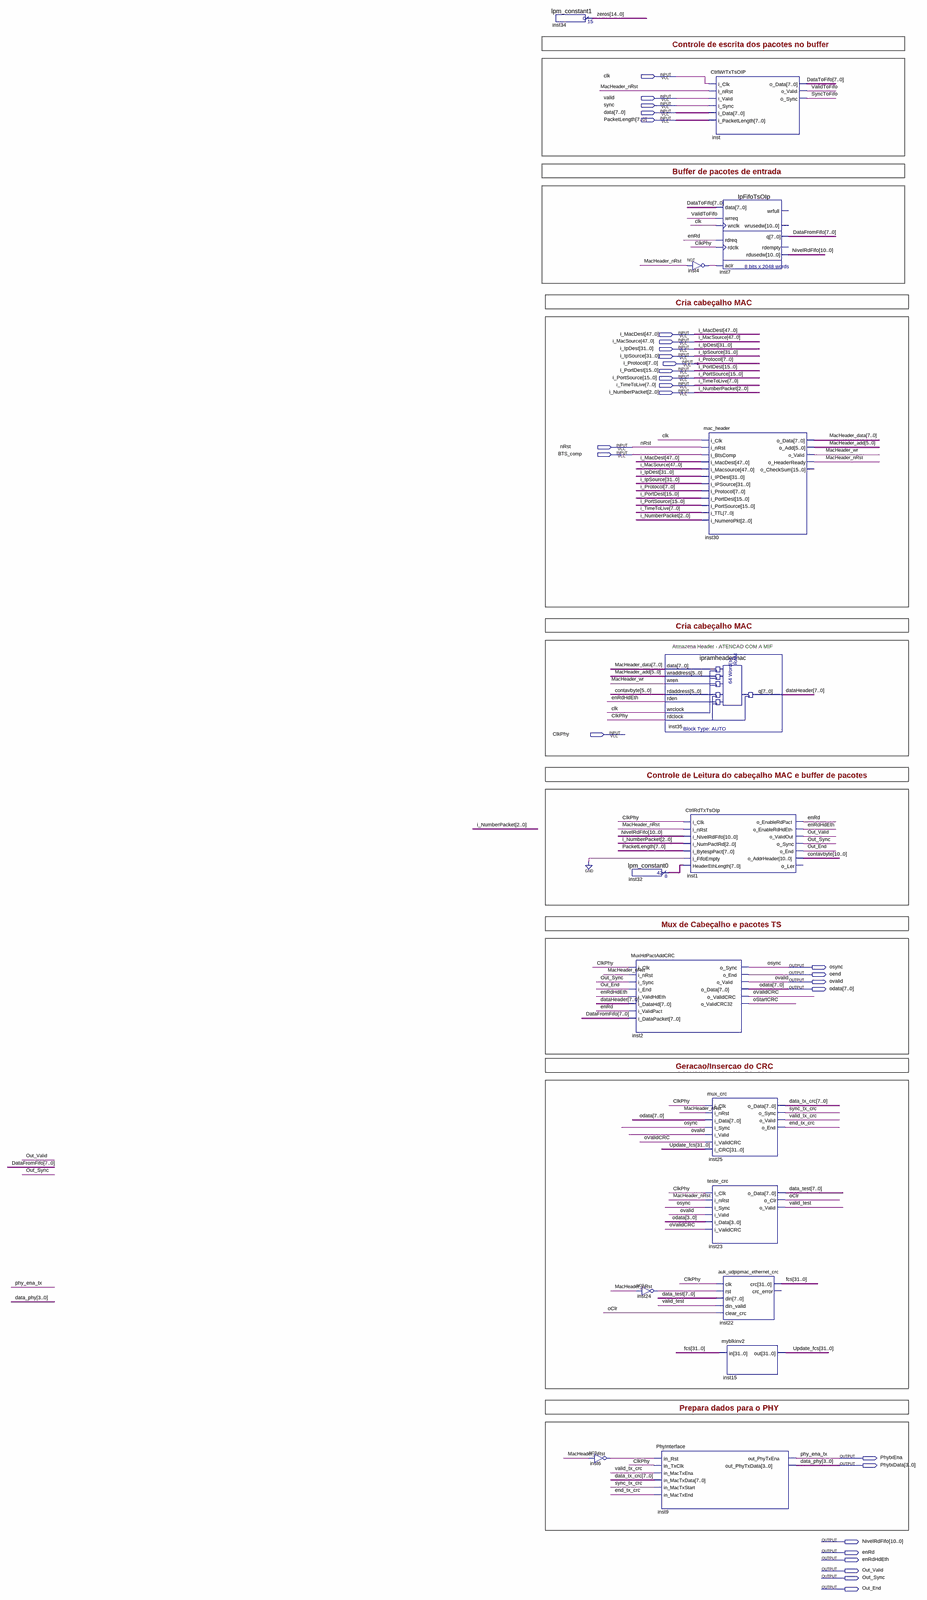
[diagram p0: schematic sheet, whole]
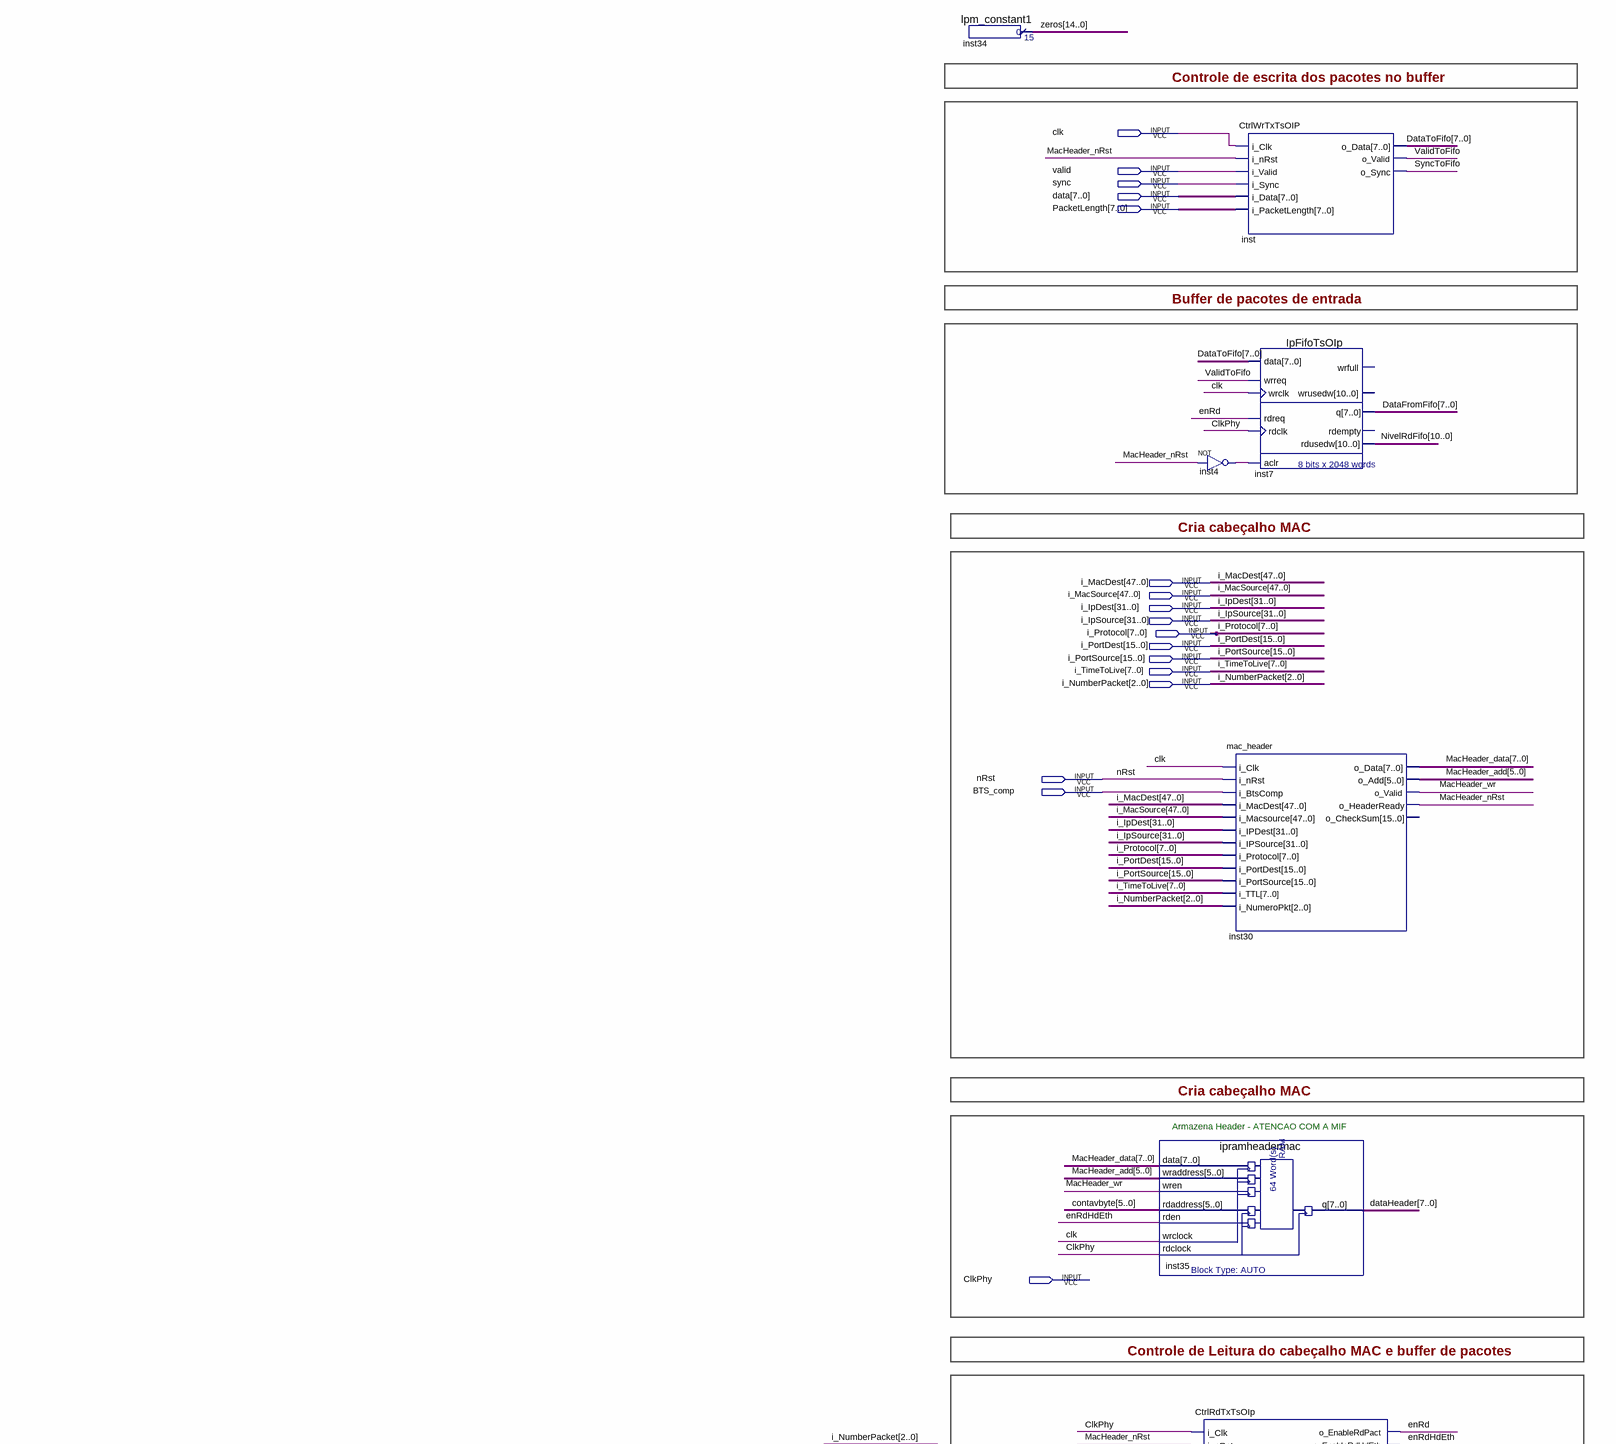
[diagram p1: schematic sheet, upper part]
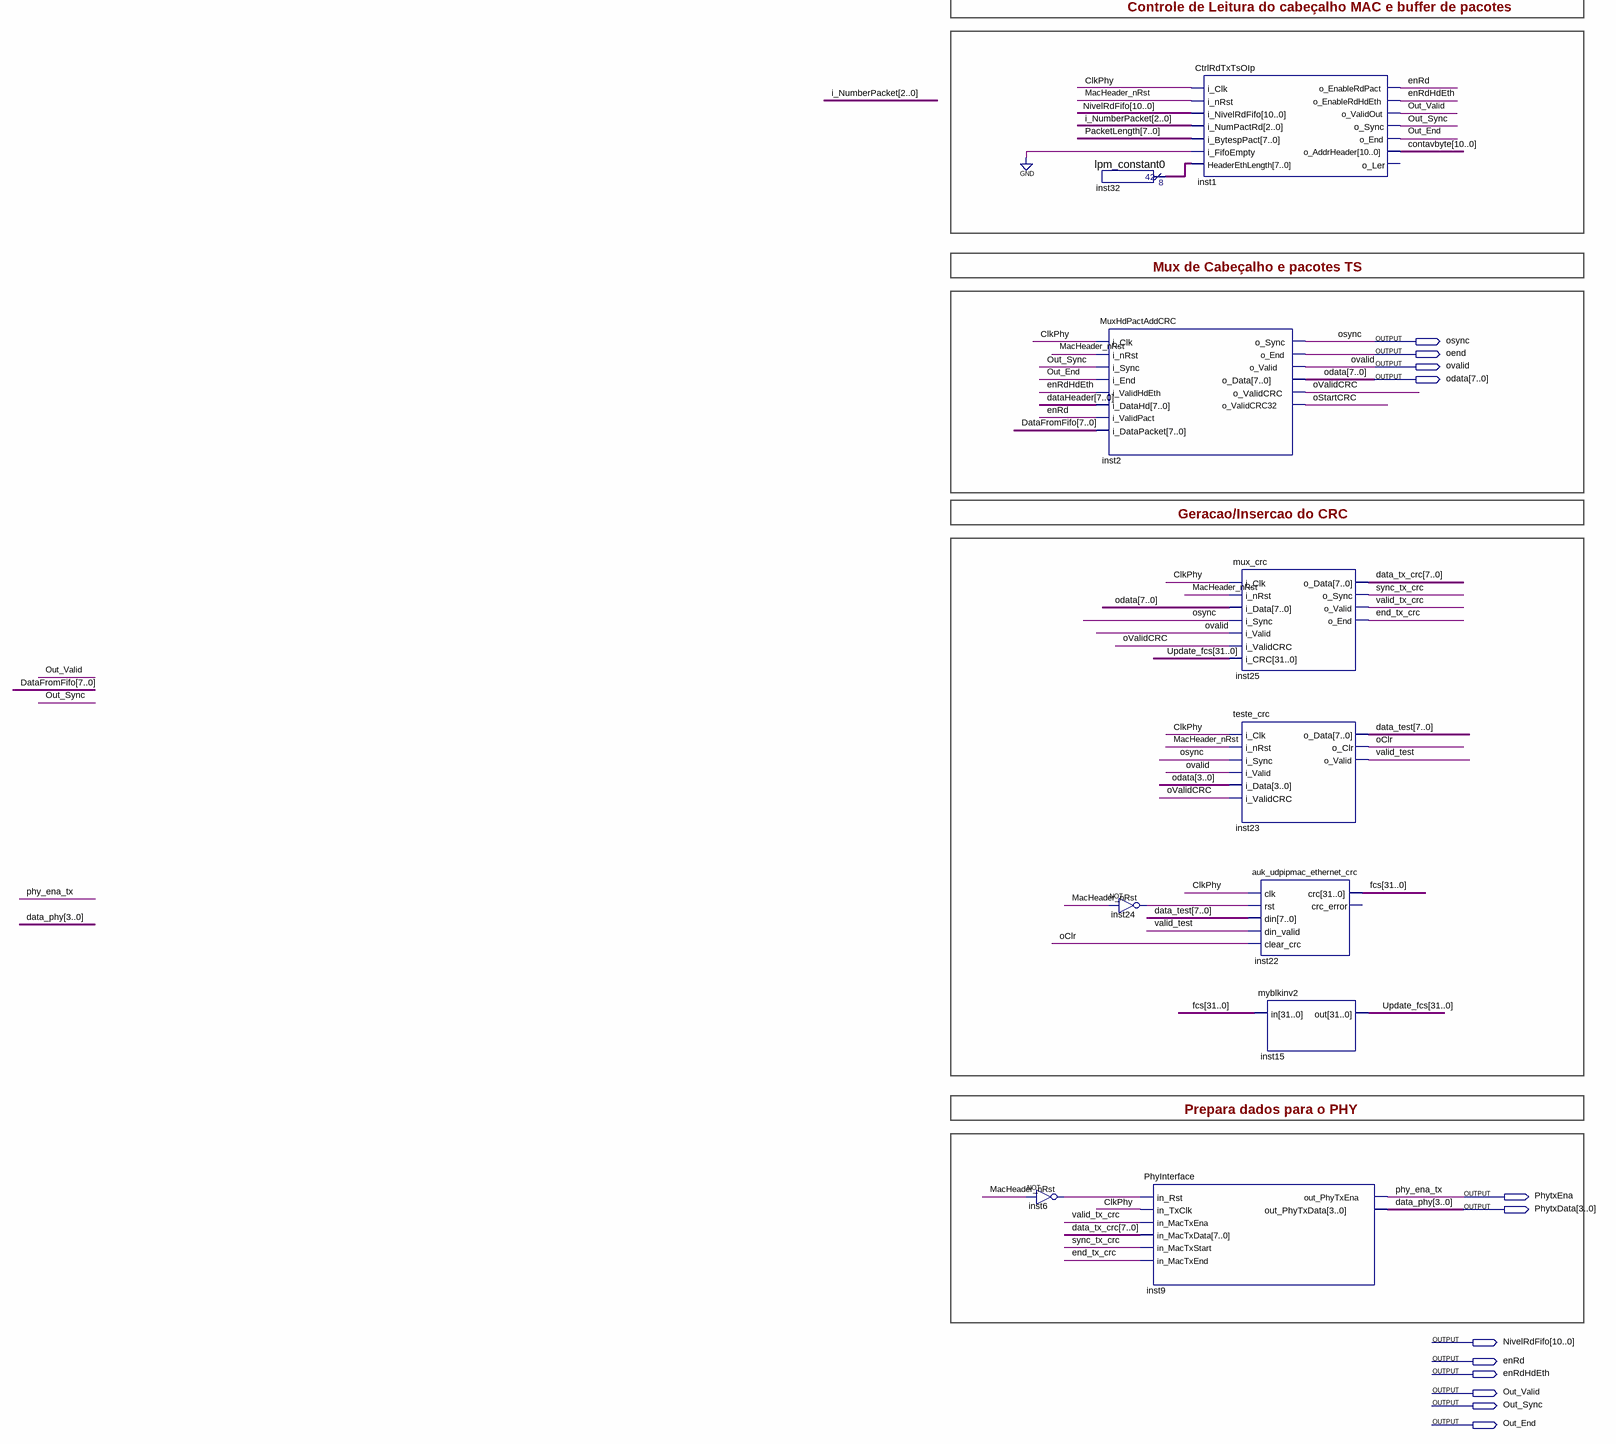
[diagram p2: schematic sheet, lower part]
// Quartus schematic TOP_TsOIp.bdf as structural Verilog: 16 symbols, 29 pins
module TOP_TsOIp (
  input  clk,
  input  valid,
  input  sync,
  input  [7:0] data,
  input  [7:0] PacketLength,
  input  [47:0] i_MacDest,
  input  [47:0] i_MacSource,
  input  [31:0] i_IpDest,
  input  [31:0] i_IpSource,
  input  [7:0] i_Protocol,
  input  [15:0] i_PortDest,
  input  [15:0] i_PortSource,
  input  [7:0] i_TimeToLive,
  input  [2:0] i_NumberPacket,
  input  nRst,
  input  BTS_comp,
  input  ClkPhy,
  output osync,
  output oend,
  output ovalid,
  output [7:0] odata,
  output PhytxEna,
  output [3:0] PhytxData,
  output [10:0] NivelRdFifo,
  output enRd,
  output enRdHdEth,
  output Out_Valid,
  output Out_Sync,
  output Out_End
);

  wire end_tx_crc, inst4_out, inst6_out, inst24_out, MacHeader_nRst, MacHeader_wr, oClr, oStartCRC,
       oValidCRC, sync_tx_crc, SyncToFifo, valid_test, valid_tx_crc, ValidToFifo;
  wire [5:0] MacHeader_add;
  wire [7:0] data_test, data_tx_crc, DataFromFifo, dataHeader, DataToFifo, inst32_result, MacHeader_data;
  wire [10:0] contavbyte;
  wire [14:0] zeros;
  wire [31:0] fcs, Update_fcs;

  lpm_constant1 inst34 (.result(zeros));
  not inst6 (inst6_out, MacHeader_nRst);
  lpm_constant0 inst32 (.result(inst32_result));
  MuxHdPactAddCRC inst2 (
    .i_Clk(ClkPhy), .i_nRst(MacHeader_nRst), .i_Sync(Out_Sync), .i_End(Out_End), .i_ValidHdEth(enRdHdEth),
    .i_DataHd(dataHeader), .i_ValidPact(enRd), .i_DataPacket(DataFromFifo), .o_Sync(osync), .o_End(oend),
    .o_Valid(ovalid), .o_Data(odata), .o_ValidCRC(oValidCRC), .o_ValidCRC32(oStartCRC));
  not inst24 (inst24_out, MacHeader_nRst);
  PhyInterface inst9 (
    .in_Rst(inst6_out), .in_TxClk(ClkPhy), .in_MacTxEna(valid_tx_crc), .in_MacTxData(data_tx_crc),
    .in_MacTxStart(sync_tx_crc), .in_MacTxEnd(end_tx_crc), .out_PhyTxEna(PhytxEna), .out_PhyTxData(PhytxData));
  ipramheadermac inst35 (
    .data(MacHeader_data), .wraddress(MacHeader_add), .wren(MacHeader_wr), .rdaddress(contavbyte[5:0]),
    .rden(enRdHdEth), .wrclock(clk), .rdclock(ClkPhy), .q(dataHeader));
  CtrlRdTxTsOIp inst1 (
    .i_Clk(ClkPhy), .i_nRst(MacHeader_nRst), .i_NivelRdFifo(NivelRdFifo), .i_NumPactRd(i_NumberPacket),
    .i_BytespPact(PacketLength), .i_FifoEmpty(1'b0), .HeaderEthLength(inst32_result), .o_EnableRdPact(enRd),
    .o_EnableRdHdEth(enRdHdEth), .o_ValidOut(Out_Valid), .o_Sync(Out_Sync), .o_End(Out_End),
    .o_AddrHeader(contavbyte));  // open: o_Ler
  CtrlWrTxTsOIP inst (
    .i_Clk(clk), .i_nRst(MacHeader_nRst), .i_Valid(valid), .i_Sync(sync), .i_Data(data),
    .i_PacketLength(PacketLength), .o_Data(DataToFifo), .o_Valid(ValidToFifo), .o_Sync(SyncToFifo));
  not inst4 (inst4_out, MacHeader_nRst);
  mac_header inst30 (
    .i_Clk(clk), .i_nRst(nRst), .i_BtsComp(BTS_comp), .i_MacDest(i_MacDest), .i_Macsource(i_MacSource),
    .i_IPDest(i_IpDest), .i_IPSource(i_IpSource), .i_Protocol(i_Protocol), .i_PortDest(i_PortDest),
    .i_PortSource(i_PortSource), .i_TTL(i_TimeToLive), .i_NumeroPkt(i_NumberPacket), .o_Data(MacHeader_data),
    .o_Add(MacHeader_add), .o_Valid(MacHeader_wr), .o_HeaderReady(MacHeader_nRst));  // open: o_CheckSum
  mux_crc inst25 (
    .i_Clk(ClkPhy), .i_nRst(MacHeader_nRst), .i_Data(odata), .i_Sync(osync), .i_Valid(ovalid),
    .i_ValidCRC(oValidCRC), .i_CRC(Update_fcs), .o_Data(data_tx_crc), .o_Sync(sync_tx_crc),
    .o_Valid(valid_tx_crc), .o_End(end_tx_crc));
  teste_crc inst23 (
    .i_Clk(ClkPhy), .i_nRst(MacHeader_nRst), .i_Sync(osync), .i_Valid(ovalid), .i_Data(odata[3:0]),
    .i_ValidCRC(oValidCRC), .o_Data(data_test), .o_Clr(oClr), .o_Valid(valid_test));
  IpFifoTsOIp inst7 (
    .data(DataToFifo), .wrreq(ValidToFifo), .wrclk(clk), .rdreq(enRd), .rdclk(ClkPhy), .aclr(inst4_out),
    .q(DataFromFifo), .rdusedw(NivelRdFifo));  // open: wrfull, wrusedw, rdempty
  auk_udpipmac_ethernet_crc inst22 (
    .clk(ClkPhy), .rst(inst24_out), .din(data_test), .din_valid(valid_test), .clear_crc(oClr), .crc(fcs));  // open: crc_error
  myblkinv2 inst15 (.in(fcs), .out(Update_fcs));

  // Other names for the same wires on the sheet: data_phy[3:0] = PhytxData; phy_ena_tx = PhytxEna

  // Notes on the sheet:
  //   Controle de escrita dos pacotes no buffer
  //   Buffer de pacotes de entrada
  //   Cria cabeçalho MAC
  //   Cria cabeçalho MAC
  //   Armazena Header - ATENCAO COM A MIF
  //   Controle de Leitura do cabeçalho MAC e buffer de pacotes
  //   Mux de Cabeçalho e pacotes TS
  //   Geracao/Insercao do CRC
  //   Prepara dados para o PHY
endmodule
